# Altium schematic sheet SoC_Decoupling_2.SchDoc: RFSoC AMC
size 420 x 297 mm; CompanyName: WUT; DrawnBy: T. Przywozki; Organization: WUT ISE; Address1: Warsaw University of Technology; Address2: Nowowiejska 15/19 00-665 Warsaw; Address3: Tomasz.Przywozki@pw.edu.pl; DocumentNumber: 41; Revision: 1; SheetNumber: 41; SheetTotal: 45; Project: RFSoC AMC; ModifiedBy: T. Przywozki; CreateDate: -; CheckedDate: -; DivGrp: ISE; Designer: T. Przywozki; ModifiedDate: -; ProjectName: ADC/DAC MEZZANINE
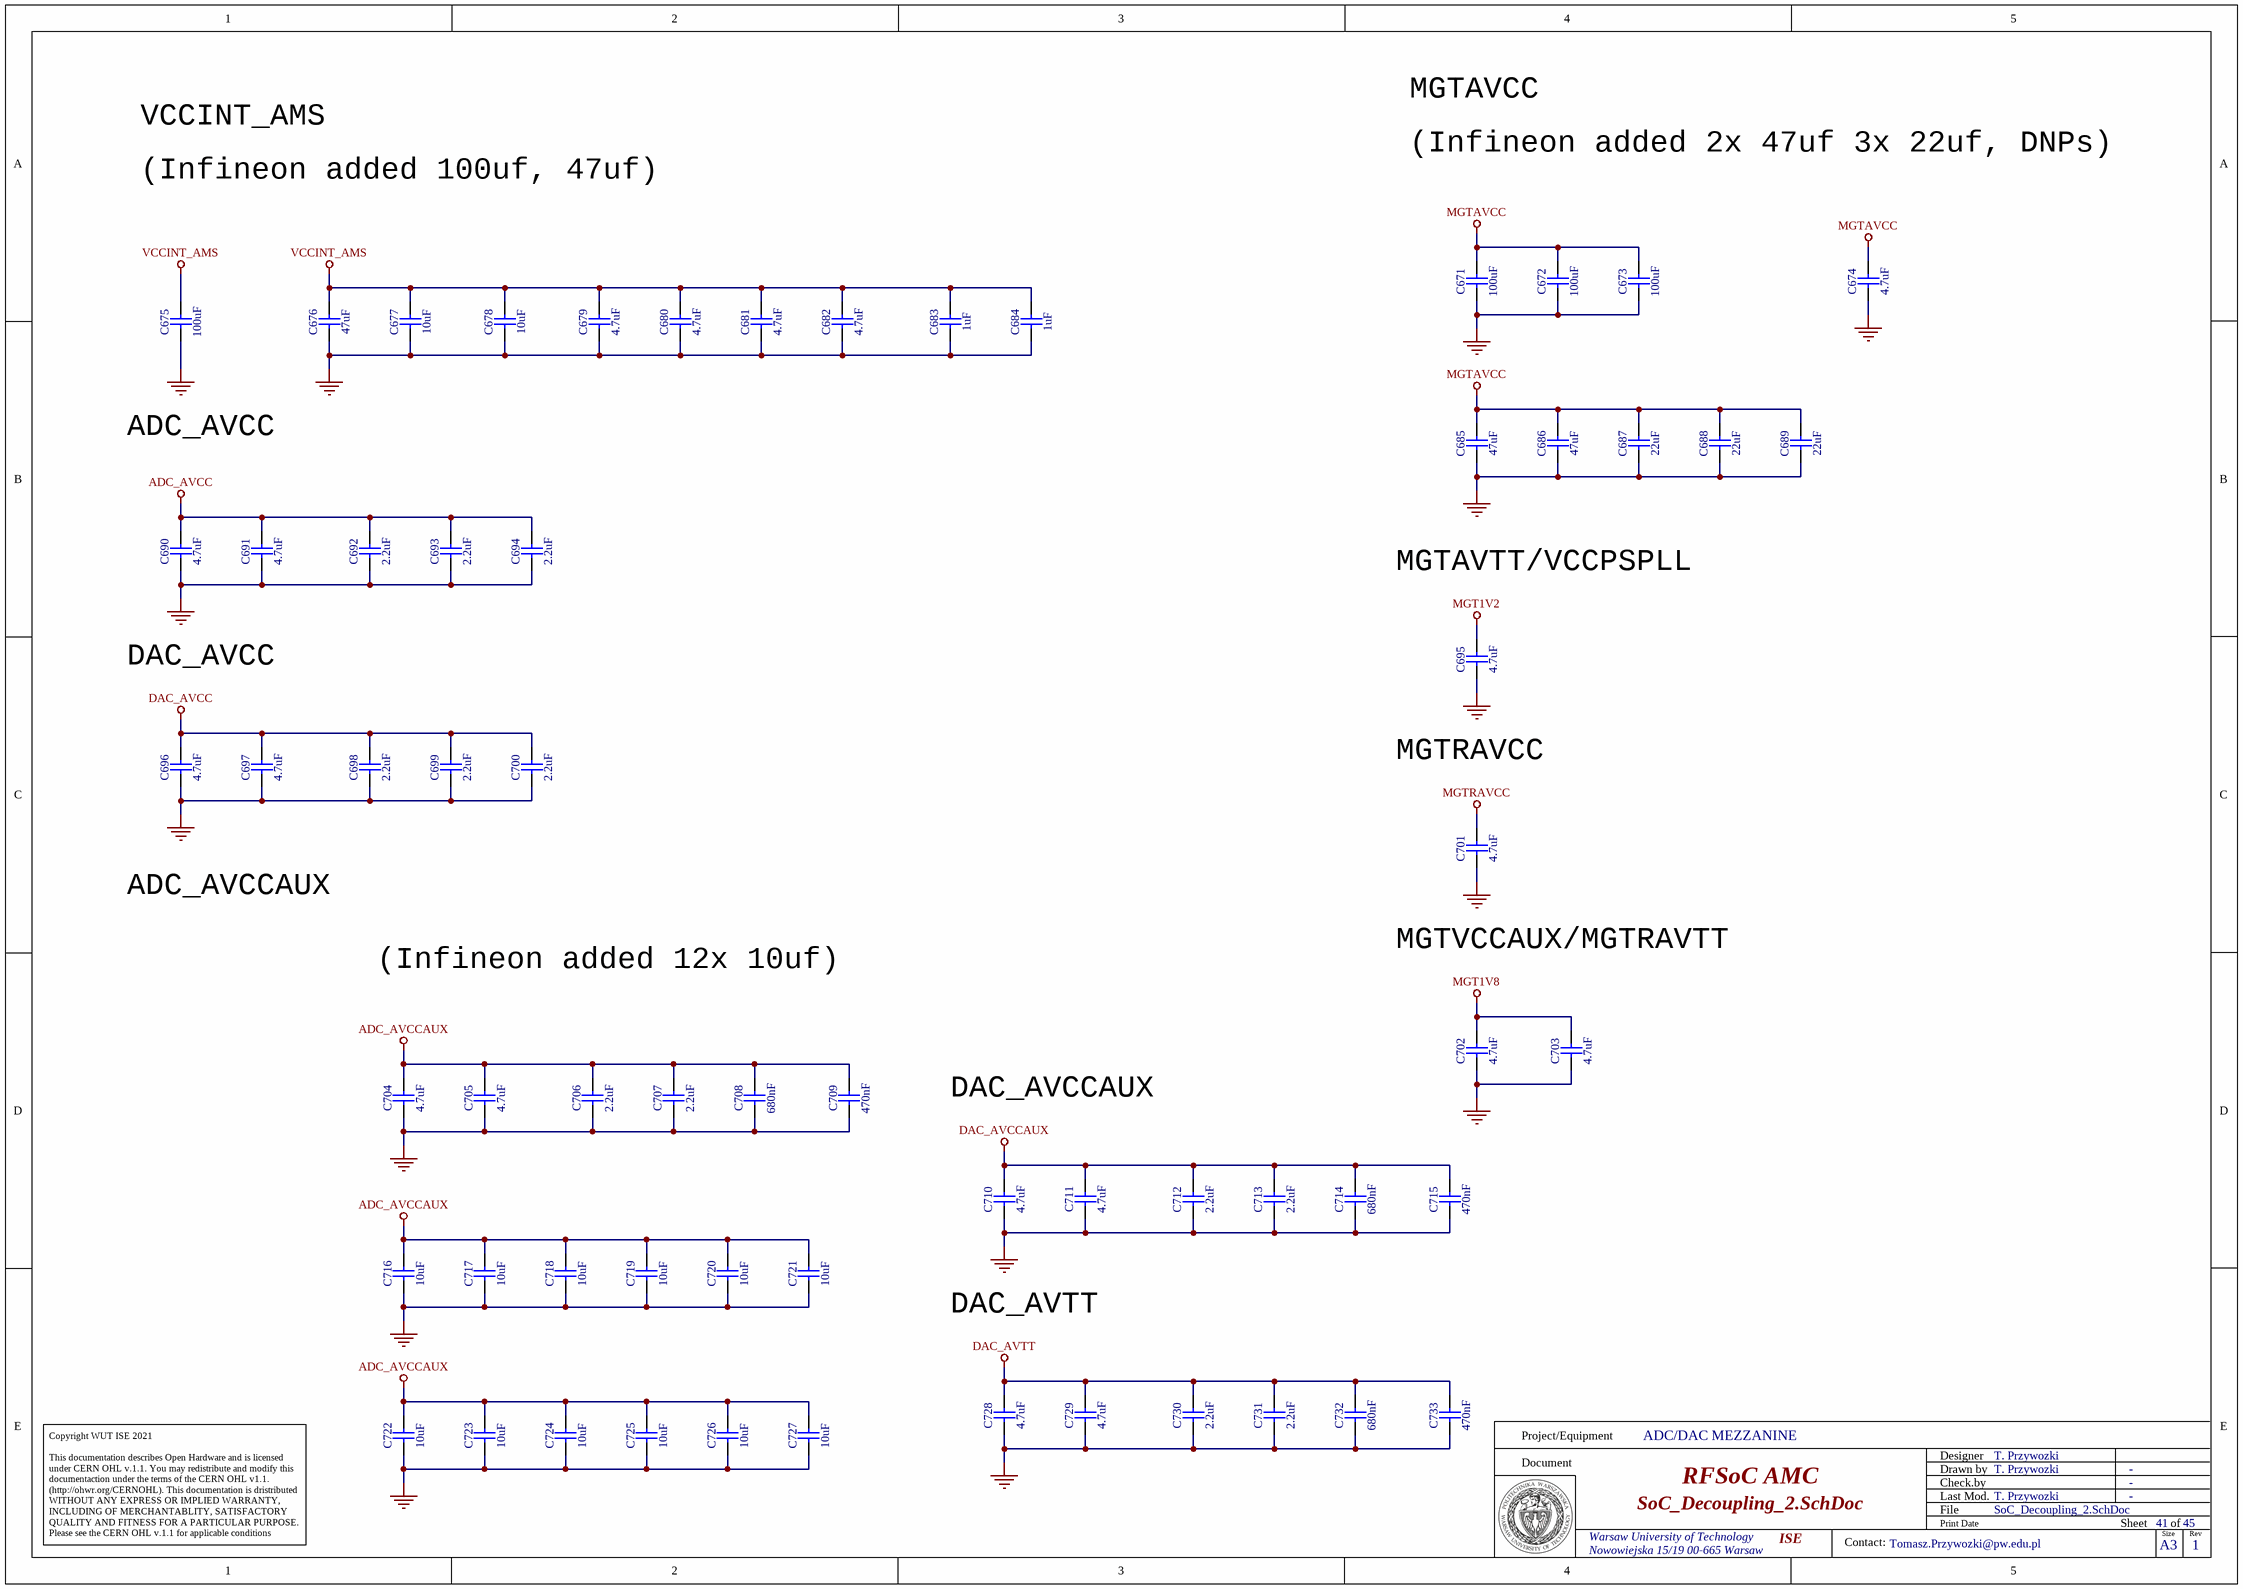
[diagram p0: SoC_Decoupling_2.SchDoc]

## Parts
C671  100uF  [CAPC3225X270N]
C672  100uF  [CAPC3225X270N]
C673  100uF  [CAPC3225X270N]
C674  4.7uF  [CAPC1005X55N]
C675  100uF  [CAPC3225X270N]
C676  47uF  [CAPC1608X100N]
C677  10uF  [CAPC1608X80N]
C678  10uF  [CAPC1608X80N]
C679  4.7uF  [CAPC1005X55N]
C680  4.7uF  [CAPC1005X55N]
C681  4.7uF  [CAPC1005X55N]
C682  4.7uF  [CAPC1005X55N]
C683  1uF  [CAPC1005X55N]
C684  1uF  [CAPC1005X55N]
C685  47uF  [CAPC1608X100N]
C686  47uF  [CAPC1608X100N]
C687  22uF  [CAPC3225X270N]
C688  22uF  [CAPC3225X270N]
C689  22uF  [CAPC3225X270N]
C690  4.7uF  [CAPC1005X55N]
C691  4.7uF  [CAPC1005X55N]
C692  2.2uF  [CAPC1005X55N]
C693  2.2uF  [CAPC1005X55N]
C694  2.2uF  [CAPC1005X55N]
C695  4.7uF  [CAPC1005X55N]
C696  4.7uF  [CAPC1005X55N]
C697  4.7uF  [CAPC1005X55N]
C698  2.2uF  [CAPC1005X55N]
C699  2.2uF  [CAPC1005X55N]
C700  2.2uF  [CAPC1005X55N]
C701  4.7uF  [CAPC1005X55N]
C702  4.7uF  [CAPC1005X55N]
C703  4.7uF  [CAPC1005X55N]
C704  4.7uF  [CAPC1005X55N]
C705  4.7uF  [CAPC1005X55N]
C706  2.2uF  [CAPC1005X55N]
C707  2.2uF  [CAPC1005X55N]
C708  680nF  [CAPC1005X55N]
C709  470nF  [CAPC1005X55N]
C710  4.7uF  [CAPC1005X55N]
C711  4.7uF  [CAPC1005X55N]
C712  2.2uF  [CAPC1005X55N]
C713  2.2uF  [CAPC1005X55N]
C714  680nF  [CAPC1005X55N]
C715  470nF  [CAPC1005X55N]
C716  10uF  [CAPC1608X80N]
C717  10uF  [CAPC1608X80N]
C718  10uF  [CAPC1608X80N]
C719  10uF  [CAPC1608X80N]
C720  10uF  [CAPC1608X80N]
C721  10uF  [CAPC1608X80N]
C722  10uF  [CAPC1608X80N]
C723  10uF  [CAPC1608X80N]
C724  10uF  [CAPC1608X80N]
C725  10uF  [CAPC1608X80N]
C726  10uF  [CAPC1608X80N]
C727  10uF  [CAPC1608X80N]
C728  4.7uF  [CAPC1005X55N]
C729  4.7uF  [CAPC1005X55N]
C730  2.2uF  [CAPC1005X55N]
C731  2.2uF  [CAPC1005X55N]
C732  680nF  [CAPC1005X55N]
C733  470nF  [CAPC1005X55N]

## Nets
ADC_AVCC: C690.2 C691.2 C692.2 C693.2 C694.2
ADC_AVCCAUX: C704.2 C705.2 C706.2 C707.2 C708.2 C709.2 C716.2 C717.2 C718.2 C719.2 C720.2 C721.2 C722.2 C723.2 C724.2 C725.2 C726.2 C727.2
DAC_AVCC: C696.2 C697.2 C698.2 C699.2 C700.2
DAC_AVCCAUX: C710.2 C711.2 C712.2 C713.2 C714.2 C715.2
DAC_AVTT: C728.2 C729.2 C730.2 C731.2 C732.2 C733.2
GND: C671.1 C672.1 C673.1 C674.1 C675.1 C676.1 C677.1 C678.1 C679.1 C680.1 C681.1 C682.1 C683.1 C684.1 C685.1 C686.1 C687.1 C688.1 C689.1 C690.1 C691.1 C692.1 C693.1 C694.1 C695.1 C696.1 C697.1 C698.1 C699.1 C700.1 C701.1 C702.1 C703.1 C704.1 C705.1 C706.1 C707.1 C708.1 C709.1 C710.1 C711.1 C712.1 C713.1 C714.1 C715.1 C716.1 C717.1 C718.1 C719.1 C720.1 C721.1 C722.1 C723.1 C724.1 C725.1 C726.1 C727.1 C728.1 C729.1 C730.1 C731.1 C732.1 C733.1
MGT1V2: C695.2
MGT1V8: C702.2 C703.2
MGTAVCC: C671.2 C672.2 C673.2 C674.2 C685.2 C686.2 C687.2 C688.2 C689.2
MGTRAVCC: C701.2
VCCINT_AMS: C675.2 C676.2 C677.2 C678.2 C679.2 C680.2 C681.2 C682.2 C683.2 C684.2

## Notes on the sheet
- VCCINT_AMS
- MGTAVCC
- (Infineon added 100uf, 47uf)
- (Infineon added 2x 47uf 3x 22uf, DNPs)
- ADC_AVCC
- MGTAVTT/VCCPSPLL
- DAC_AVCC
- MGTRAVCC
- ADC_AVCCAUX
- (Infineon added 12x 10uf)
- MGTVCCAUX/MGTRAVTT
- DAC_AVCCAUX
- DAC_AVTT
- Project/Equipment
- Document
- Designer
- Drawn by
- Check.by
- Copyright WUT ISE 2021
  This documentation describes Open Hardware and is licensed under CERN OHL v.1.1. You may redistribute and modify this documentaction under the terms of the CERN OHL v1.1.
  (http://ohwr.org/CERNOHL). This documentation is dristributed WITHOUT ANY EXPRESS OR IMPLIED WARRANTY, INCLUDING OF MERCHANTABLITY, SATISFACTORY QUALITY AND FITNESS FOR A PARTICULAR PURPOSE. Please see the CERN OHL v.1.1 for applicable conditions
- File
- Last Mod.
- Print Date
- Sheet
- Size
- A3
- of
- Rev
- Contact:

## Library data of the parts
C671-C673 C675 = CC1210_100UF_6.3V_20%_X5R: Non-polarised capacitor; Part Description: SMD Multilayer Chip Ceramic Capacitor; Manufacturer: GENERIC; Manufacturer1 Part Number: GRM32ER60J107ME20L; Voltage: 6.3V; Tolerance: ±20%; TC: X5R; Part Number: CC1210_100UF_6.3V_20%_X5R; Component Kind: Standard; Component Type: Standard; Pin Count: 2; Value: 100uF; Status: Preferred; Manufacturer Part Number: CC1210_100UF_6.3V_20%_X5R; Case: 1210; Mounted: Yes; Socket: No; SMD: Yes; Sense: No; Manufacturer1 Example: MURATA; Manufacturer1 ComponentHeight: 2.7mm; HelpURL: \\cern.ch\dfs\Applications\Altium\Datasheets\CC1210_X5R_MURATA.pdf; Author: CERN DEM JLC; CreateDate: 19.04.2010; LatestRevisionDate: 19.04.2010
C674 C679-C682 C690 C691 C695-C697 C701-C705 C710 C711 C728 C729 = CC0402_4.7UF_6.3V_20%_X5R: Non-polarised capacitor; Part Description: SMD Multilayer Chip Ceramic Capacitor; Manufacturer: GENERIC; Manufacturer1 Part Number: C1005X5R0J475M050BC; Voltage: 6.3V; Tolerance: ±20%; TC: X5R; Part Number: CC0402_4.7UF_6.3V_20%_X5R; Component Kind: Standard; Component Type: Standard; Pin Count: 2; Value: 4.7uF; Status: Preferred; Manufacturer Part Number: CC0402_4.7UF_6.3V_20%_X5R; Case: 0402; Mounted: Yes; Socket: No; SMD: Yes; Sense: No; Manufacturer1 Example: TDK; Manufacturer1 ComponentHeight: 0.65mm; HelpURL: \\cern.ch\dfs\Applications\Altium\Datasheets\CC0402_X5R_TDK_C.pdf; Author: CERN DEM JLC; CreateDate: 03.03.2015; LatestRevisionDate: 03.03.2015
C676 C685 C686 = CC0603_47UF_6.3V_20%_X5R: Non-polarised capacitor; Part Description: SMD Multilayer Chip Ceramic Capacitor; Manufacturer: GENERIC; Manufacturer1 Part Number: GRM188R60J476ME15D; Voltage: 6.3V; Tolerance: ±20%; TC: X5R; Part Number: CC0603_47UF_6.3V_20%_X5R; Component Kind: Standard; Component Type: Standard; Pin Count: 2; Value: 47uF; Status: None; Manufacturer Part Number: CC0603_47UF_6.3V_20%_X5R; Case: 0603; Mounted: Yes; Socket: No; SMD: Yes; Sense: No; Manufacturer1 Example: MURATA; Manufacturer1 ComponentHeight: 1mm; HelpURL: \\cern.ch\dfs\Applications\Altium\Datasheets\CC0603_MURATA_GRM188R60J476ME15D.pdf; Author: CERN DEM JLC; CreateDate: 01.02.2018; LatestRevisionDate: 01.02.2018
C677 C678 C716-C727 = CC0603_10UF_10V_10%_X5R: Non-polarised capacitor; Part Description: SMD Multilayer Chip Ceramic Capacitor; Manufacturer: GENERIC; Manufacturer1 Part Number: GRM188R61A106KE69D; Voltage: 10V; Tolerance: ±10%; TC: X5R; Part Number: CC0603_10UF_10V_10%_X5R; Component Kind: Standard; Component Type: Standard; Pin Count: 2; Value: 10uF; Status: None; Manufacturer Part Number: CC0603_10UF_10V_10%_X5R; Case: 0603; Mounted: Yes; Socket: No; SMD: Yes; Sense: No; Manufacturer1 Example: MURATA; Manufacturer1 ComponentHeight: 0.8mm; HelpURL: \\cern.ch\dfs\Applications\Altium\Datasheets\CC0603_MURATA_GRM188R61A106KE69D.pdf; Author: CERN DEM JLC; CreateDate: 31.01.2017; LatestRevisionDate: 31.01.2017
C683 C684 = CC0402_1UF_16V_10%_X5R: Non-polarised capacitor; Part Description: SMD Multilayer Chip Ceramic Capacitor; Manufacturer: GENERIC; Manufacturer1 Part Number: C1005X5R1C105KT; Voltage: 16V; Tolerance: ±10%; TC: X5R; Part Number: CC0402_1UF_16V_10%_X5R; Component Kind: Standard; Component Type: Standard; Pin Count: 2; Value: 1uF; Status: Preferred; Manufacturer Part Number: CC0402_1UF_16V_10%_X5R; Case: 0402; Mounted: Yes; Socket: No; SMD: Yes; Sense: No; Manufacturer1 Example: TDK; Manufacturer1 ComponentHeight: 0.55mm; HelpURL: \\cern.ch\dfs\Applications\Altium\Datasheets\CC0402_X5R_TDK_C.pdf; Author: CERN DEM JLC; CreateDate: 25.10.2012; LatestRevisionDate: 25.10.2012
C687-C689 = CC1210_22UF_25V_10%_X5R: Non-polarised capacitor; Part Description: SMD Multilayer Chip Ceramic Capacitor; Manufacturer: GENERIC; Manufacturer1 Part Number: 12103D226KAT2A; Voltage: 25V; Tolerance: ±10%; TC: X5R; Part Number: CC1210_22UF_25V_10%_X5R; Component Kind: Standard; Component Type: Standard; Pin Count: 2; Value: 22uF; Status: Preferred; Manufacturer Part Number: CC1210_22UF_25V_10%_X5R; Case: 1210; Mounted: Yes; Socket: No; SMD: Yes; Sense: No; Manufacturer1 Example: AVX; Manufacturer1 ComponentHeight: 2.79mm; HelpURL: \\cern.ch\dfs\Applications\Altium\Datasheets\CC1210_X5R_AVX.pdf; Author: CERN DEM JLC; CreateDate: 12.11.2014; LatestRevisionDate: 12.11.2014
C692-C694 C698-C700 C706 C707 C712 C713 C730 C731 = CC0402_2.2UF_6.3V_10%_X5R: Non-polarised capacitor; Part Description: SMD Multilayer Chip Ceramic Capacitor; Manufacturer: GENERIC; Manufacturer1 Part Number: C1005X5R0J225K050BC; Voltage: 6.3V; Tolerance: ±10%; TC: X5R; Part Number: CC0402_2.2UF_6.3V_10%_X5R; Component Kind: Standard; Component Type: Standard; Pin Count: 2; Value: 2.2uF; Status: Preferred; Manufacturer Part Number: CC0402_2.2UF_6.3V_10%_X5R; Case: 0402; Mounted: Yes; Socket: No; SMD: Yes; Sense: No; Manufacturer1 Example: TDK; Manufacturer1 ComponentHeight: 0.55mm; HelpURL: \\cern.ch\dfs\Applications\Altium\Datasheets\CC0402_X5R_TDK_C.pdf; Author: CERN DEM JMW; CreateDate: 22.09.2015; LatestRevisionDate: 22.09.2015
C708 C714 C732 = CC0402_680NF_10V_10%_X5R: Non-polarised capacitor; Part Description: SMD Multilayer Chip Ceramic Capacitor; Manufacturer: GENERIC; Manufacturer1 Part Number: GRM155R61A684KE15; Voltage: 10V; TC: X5R; Tolerance: ±10%; Part Number: CC0402_680NF_10V_10%_X5R; Component Kind: Standard; Component Type: Standard; Pin Count: 2; Value: 680nF; Status: None; Manufacturer Part Number: CC0402_680NF_10V_10%_X5R; Case: 0402; Mounted: Yes; Socket: No; SMD: Yes; Sense: No; Manufacturer1 Example: MURATA; Manufacturer1 ComponentHeight: 0.55mm; HelpURL: \\cern.ch\dfs\Applications\Altium\Datasheets\CC0402_X5R_MURATA_GRM.pdf; Author: CERN DEM BC; CreateDate: 19.04.2021; LatestRevisionDate: 19.04.2021
C709 C715 C733 = CC0402_470NF_6.3V_10%_X5R: Non-polarised capacitor; Part Description: SMD Multilayer Chip Ceramic Capacitor; Manufacturer: GENERIC; Manufacturer1 Part Number: GRM155R60J474KE19D; Voltage: 6.3V; Tolerance: ±10%; TC: X5R; Part Number: CC0402_470NF_6.3V_10%_X5R; Component Kind: Standard; Component Type: Standard; Pin Count: 2; Value: 470nF; Status: Preferred; Manufacturer Part Number: CC0402_470NF_6.3V_10%_X5R; Case: 0402; Mounted: Yes; Socket: No; SMD: Yes; Sense: No; Manufacturer1 Example: MURATA; Manufacturer1 ComponentHeight: 0.55mm; HelpURL: \\cern.ch\dfs\Applications\Altium\Datasheets\CC0402_X5R_MURATA_GRM.pdf; Author: CERN DEM JLC; CreateDate: 22.04.2010; LatestRevisionDate: 22.04.2010